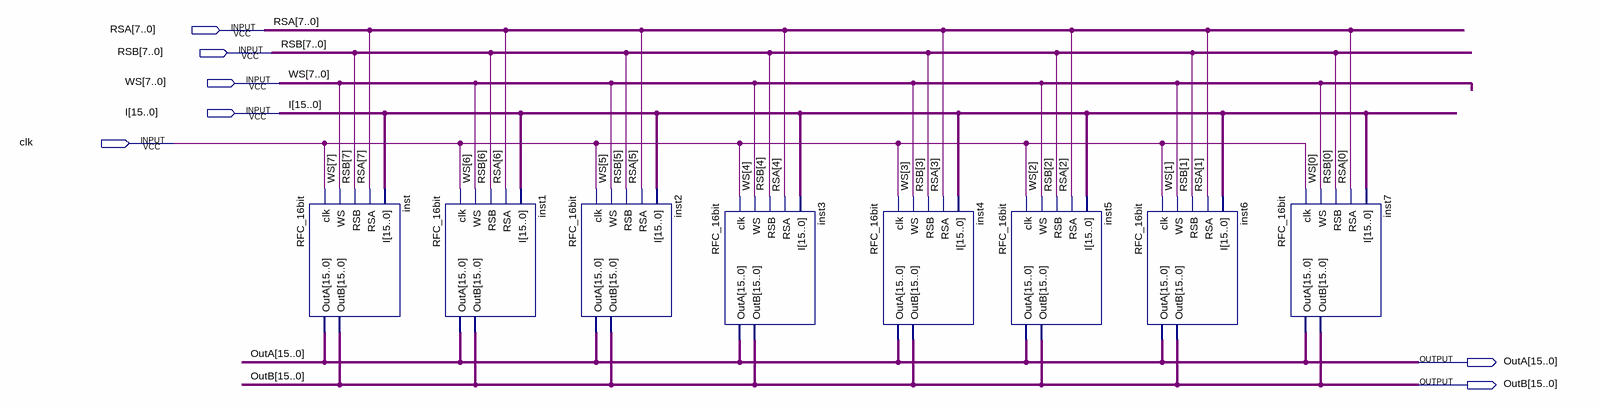
[diagram p0: schematic sheet]
// Quartus schematic RFC8x16.bdf as structural Verilog: 8 symbols, 7 pins
module RFC8x16 (
  input  [7:0] RSA,
  input  [7:0] RSB,
  input  [7:0] WS,
  input  [15:0] I,
  input  clk,
  output [15:0] OutA,
  output [15:0] OutB
);

  RFC_16bit inst (.clk(clk), .WS(WS[7]), .RSB(RSB[7]), .RSA(RSA[7]), .I(I), .OutA(OutA), .OutB(OutB));
  RFC_16bit inst1 (.clk(clk), .WS(WS[6]), .RSB(RSB[6]), .RSA(RSA[6]), .I(I), .OutA(OutA), .OutB(OutB));
  RFC_16bit inst2 (.clk(clk), .WS(WS[5]), .RSB(RSB[5]), .RSA(RSA[5]), .I(I), .OutA(OutA), .OutB(OutB));
  RFC_16bit inst3 (.clk(clk), .WS(WS[4]), .RSB(RSB[4]), .RSA(RSA[4]), .I(I), .OutA(OutA), .OutB(OutB));
  RFC_16bit inst4 (.clk(clk), .WS(WS[3]), .RSB(RSB[3]), .RSA(RSA[3]), .I(I), .OutA(OutA), .OutB(OutB));
  RFC_16bit inst5 (.clk(clk), .WS(WS[2]), .RSB(RSB[2]), .RSA(RSA[2]), .I(I), .OutA(OutA), .OutB(OutB));
  RFC_16bit inst6 (.clk(clk), .WS(WS[1]), .RSB(RSB[1]), .RSA(RSA[1]), .I(I), .OutA(OutA), .OutB(OutB));
  RFC_16bit inst7 (.clk(clk), .WS(WS[0]), .RSB(RSB[0]), .RSA(RSA[0]), .I(I), .OutA(OutA), .OutB(OutB));
endmodule
